# Altium schematic sheet EXP_Headers.SchDoc: EXP Headers
size A; Revision: 1
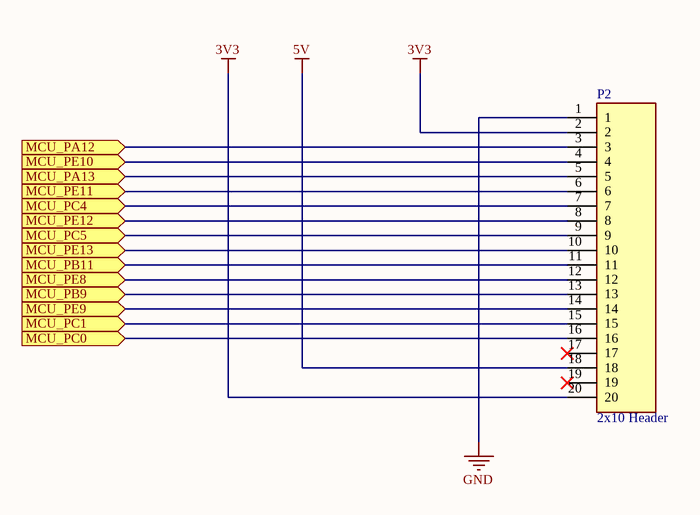
[diagram p0: EXP_Headers.SchDoc]

## Parts
P2  2x10 Header  [2x10 Header]

## Ports
MCU_PA12 (in), MCU_PA13 (in), MCU_PB9 (in), MCU_PB11 (in), MCU_PC0 (in), MCU_PC1 (in), MCU_PC4 (in), MCU_PC5 (in), MCU_PE8 (in), MCU_PE9 (in), MCU_PE10 (in), MCU_PE11 (in), MCU_PE12 (in), MCU_PE13 (in)

## Nets
3V3: P2.2 P2.20
5V: P2.18
GND: P2.1
MCU_PA12: P2.3 ; port MCU_PA12
MCU_PA13: P2.5 ; port MCU_PA13
MCU_PB9: P2.13 ; port MCU_PB9
MCU_PB11: P2.11 ; port MCU_PB11
MCU_PC0: P2.16 ; port MCU_PC0
MCU_PC1: P2.15 ; port MCU_PC1
MCU_PC4: P2.7 ; port MCU_PC4
MCU_PC5: P2.9 ; port MCU_PC5
MCU_PE8: P2.12 ; port MCU_PE8
MCU_PE9: P2.14 ; port MCU_PE9
MCU_PE10: P2.4 ; port MCU_PE10
MCU_PE11: P2.6 ; port MCU_PE11
MCU_PE12: P2.8 ; port MCU_PE12
MCU_PE13: P2.10 ; port MCU_PE13

Not connected (* = marked no-connect by the designer): P2 17* 19*

## Library data of the parts
P2 = 2x10 Header: HE2P-20G6C394-5R, 2.54 mm pegs.; MP: 1-826944-0; Number_of_Positions: 20; Product_Type: Connector; MF: TE Connectivity; Centerline_Pitch: 2.54 mm[.1 in]; Package: None; TE_purchase_URL: https://www.te.com/usa-en/product-1-826944-0.html?te_bu=Cor&te_type=disp&te_campaign=seda_glo_cor-seda-global-disp-prtnr-fy19-seda-model-bom-cta_sma-317_1&elqCampaignId=32493; Price: None; EU_RoHS_Compliance: Compliant; Value: *; SnapEDA_Link: https://www.snapeda.com/parts/1-826944-0/TE%20Connectivity%20AMP%20Connectors/view-part/517829/?ref=snap; Availability: Unavailable